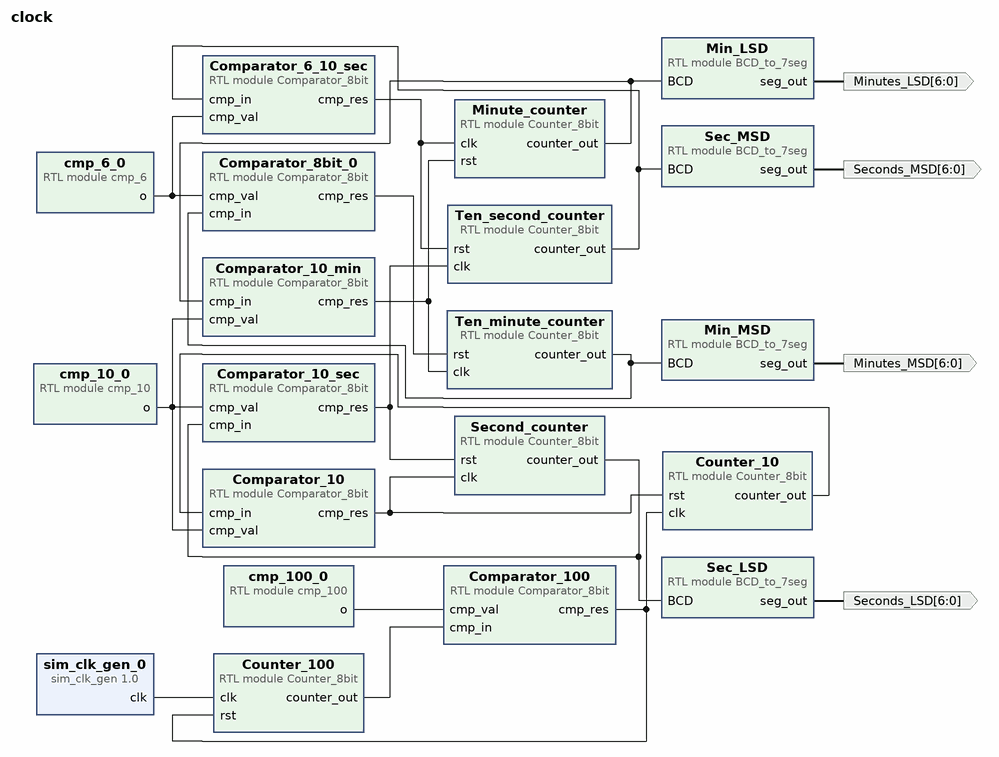
[diagram p0: block diagram of the top level]
# Vivado block design clock, xc7z020clg400-1, Vivado 2023.2
create_bd_design clock

create_bd_port -dir O -from 6 -to 0 Seconds_LSD
create_bd_port -dir O -from 6 -to 0 Seconds_MSD
create_bd_port -dir O -from 6 -to 0 Minutes_LSD
create_bd_port -dir O -from 6 -to 0 Minutes_MSD

create_bd_cell -type ip -vlnv xilinx.com:ip:sim_clk_gen:1.0 sim_clk_gen_0
set_property -dict {CONFIG.FREQ_HZ 1000 CONFIG.RESET_POLARITY ACTIVE_LOW} [get_bd_cells sim_clk_gen_0]
create_bd_cell -type module -reference Counter_8bit Counter_100
create_bd_cell -type module -reference Comparator_8bit Comparator_100
create_bd_cell -type module -reference Counter_8bit Second_counter
create_bd_cell -type module -reference Comparator_8bit Comparator_10_sec
create_bd_cell -type module -reference Counter_8bit Ten_second_counter
create_bd_cell -type module -reference Comparator_8bit Comparator_6_10_sec
create_bd_cell -type module -reference Counter_8bit Minute_counter
create_bd_cell -type module -reference Comparator_8bit Comparator_10_min
create_bd_cell -type module -reference Counter_8bit Ten_minute_counter
create_bd_cell -type module -reference Counter_8bit Counter_10
create_bd_cell -type module -reference Comparator_8bit Comparator_10
create_bd_cell -type module -reference cmp_100 cmp_100_0
create_bd_cell -type module -reference cmp_10 cmp_10_0
create_bd_cell -type module -reference Comparator_8bit Comparator_8bit_0
create_bd_cell -type module -reference cmp_6 cmp_6_0
create_bd_cell -type module -reference BCD_to_7seg Sec_LSD
create_bd_cell -type module -reference BCD_to_7seg Sec_MSD
create_bd_cell -type module -reference BCD_to_7seg Min_LSD
create_bd_cell -type module -reference BCD_to_7seg Min_MSD

# ---- connections ----

connect_bd_net -net BCD_to_7seg_0_seg_out [get_bd_pins Sec_LSD/seg_out] [get_bd_ports Seconds_LSD]
connect_bd_net -net Comparator_100_output [get_bd_pins Comparator_100/cmp_res] [get_bd_pins Counter_100/rst] [get_bd_pins Counter_10/clk]
connect_bd_net [get_bd_pins Comparator_10/cmp_res] [get_bd_pins Second_counter/clk] [get_bd_pins Counter_10/rst]
connect_bd_net -net Comparator_6_10_sec_output [get_bd_pins Comparator_6_10_sec/cmp_res] \
  [get_bd_pins Ten_second_counter/rst] [get_bd_pins Minute_counter/clk]
connect_bd_net -net Comparator_8bit_0_output [get_bd_pins Comparator_8bit_0/cmp_res] [get_bd_pins Ten_minute_counter/rst]
connect_bd_net -net Comparator_8bit_0_output1 [get_bd_pins Comparator_10_sec/cmp_res] \
  [get_bd_pins Second_counter/rst] [get_bd_pins Ten_second_counter/clk]
connect_bd_net -net Comparator_8bit_0_output2 [get_bd_pins Comparator_10_min/cmp_res] \
  [get_bd_pins Minute_counter/rst] [get_bd_pins Ten_minute_counter/clk]
connect_bd_net [get_bd_pins Counter_10/counter_out] [get_bd_pins Comparator_10/cmp_in]
connect_bd_net [get_bd_pins Min_LSD/seg_out] [get_bd_ports Minutes_LSD]
connect_bd_net [get_bd_pins Min_MSD/seg_out] [get_bd_ports Minutes_MSD]
connect_bd_net [get_bd_pins Minute_counter/counter_out] [get_bd_pins Min_LSD/BCD] [get_bd_pins Comparator_10_min/cmp_in]
connect_bd_net -net Sec_LSD1_seg_out [get_bd_pins Sec_MSD/seg_out] [get_bd_ports Seconds_MSD]
connect_bd_net [get_bd_pins Second_counter/counter_out] [get_bd_pins Sec_LSD/BCD] [get_bd_pins Comparator_10_sec/cmp_in]
connect_bd_net [get_bd_pins Ten_minute_counter/counter_out] [get_bd_pins Min_MSD/BCD] [get_bd_pins Comparator_8bit_0/cmp_in]
connect_bd_net [get_bd_pins Ten_second_counter/counter_out] [get_bd_pins Sec_MSD/BCD] [get_bd_pins Comparator_6_10_sec/cmp_in]
connect_bd_net [get_bd_pins cmp_100_0/o] [get_bd_pins Comparator_100/cmp_val]
connect_bd_net [get_bd_pins cmp_10_0/o] \
  [get_bd_pins Comparator_10_sec/cmp_val] [get_bd_pins Comparator_10_min/cmp_val] [get_bd_pins Comparator_10/cmp_val]
connect_bd_net [get_bd_pins cmp_6_0/o] [get_bd_pins Comparator_6_10_sec/cmp_val] [get_bd_pins Comparator_8bit_0/cmp_val]
connect_bd_net -net one_second_counter_out [get_bd_pins Counter_100/counter_out] [get_bd_pins Comparator_100/cmp_in]
connect_bd_net [get_bd_pins sim_clk_gen_0/clk] [get_bd_pins Counter_100/clk]

validate_bd_design
save_bd_design
